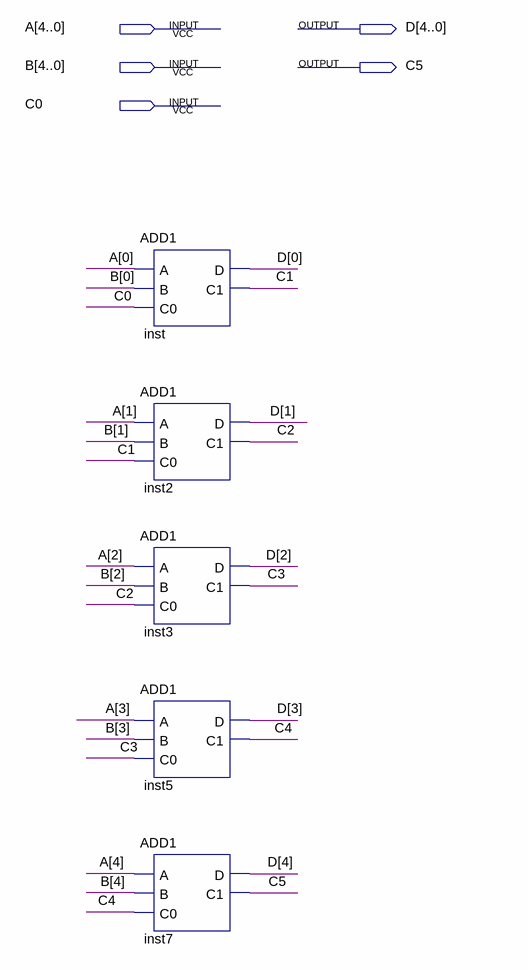
[diagram p0: schematic sheet]
// Quartus schematic ADD5.bdf as structural Verilog: 5 symbols, 5 pins
module ADD5 (
  input  [4:0] A,
  input  [4:0] B,
  input  C0,
  output [4:0] D,
  output C5
);

  wire C1, C2, C3, C4;

  ADD1 inst (.A(A[0]), .B(B[0]), .C0(C0), .D(D[0]), .C1(C1));
  ADD1 inst2 (.A(A[1]), .B(B[1]), .C0(C1), .D(D[1]), .C1(C2));
  ADD1 inst3 (.A(A[2]), .B(B[2]), .C0(C2), .D(D[2]), .C1(C3));
  ADD1 inst5 (.A(A[3]), .B(B[3]), .C0(C3), .D(D[3]), .C1(C4));
  ADD1 inst7 (.A(A[4]), .B(B[4]), .C0(C4), .D(D[4]), .C1(C5));
endmodule
